# EAGLE design ESP32_breakout (EAGLE 9.1.3)
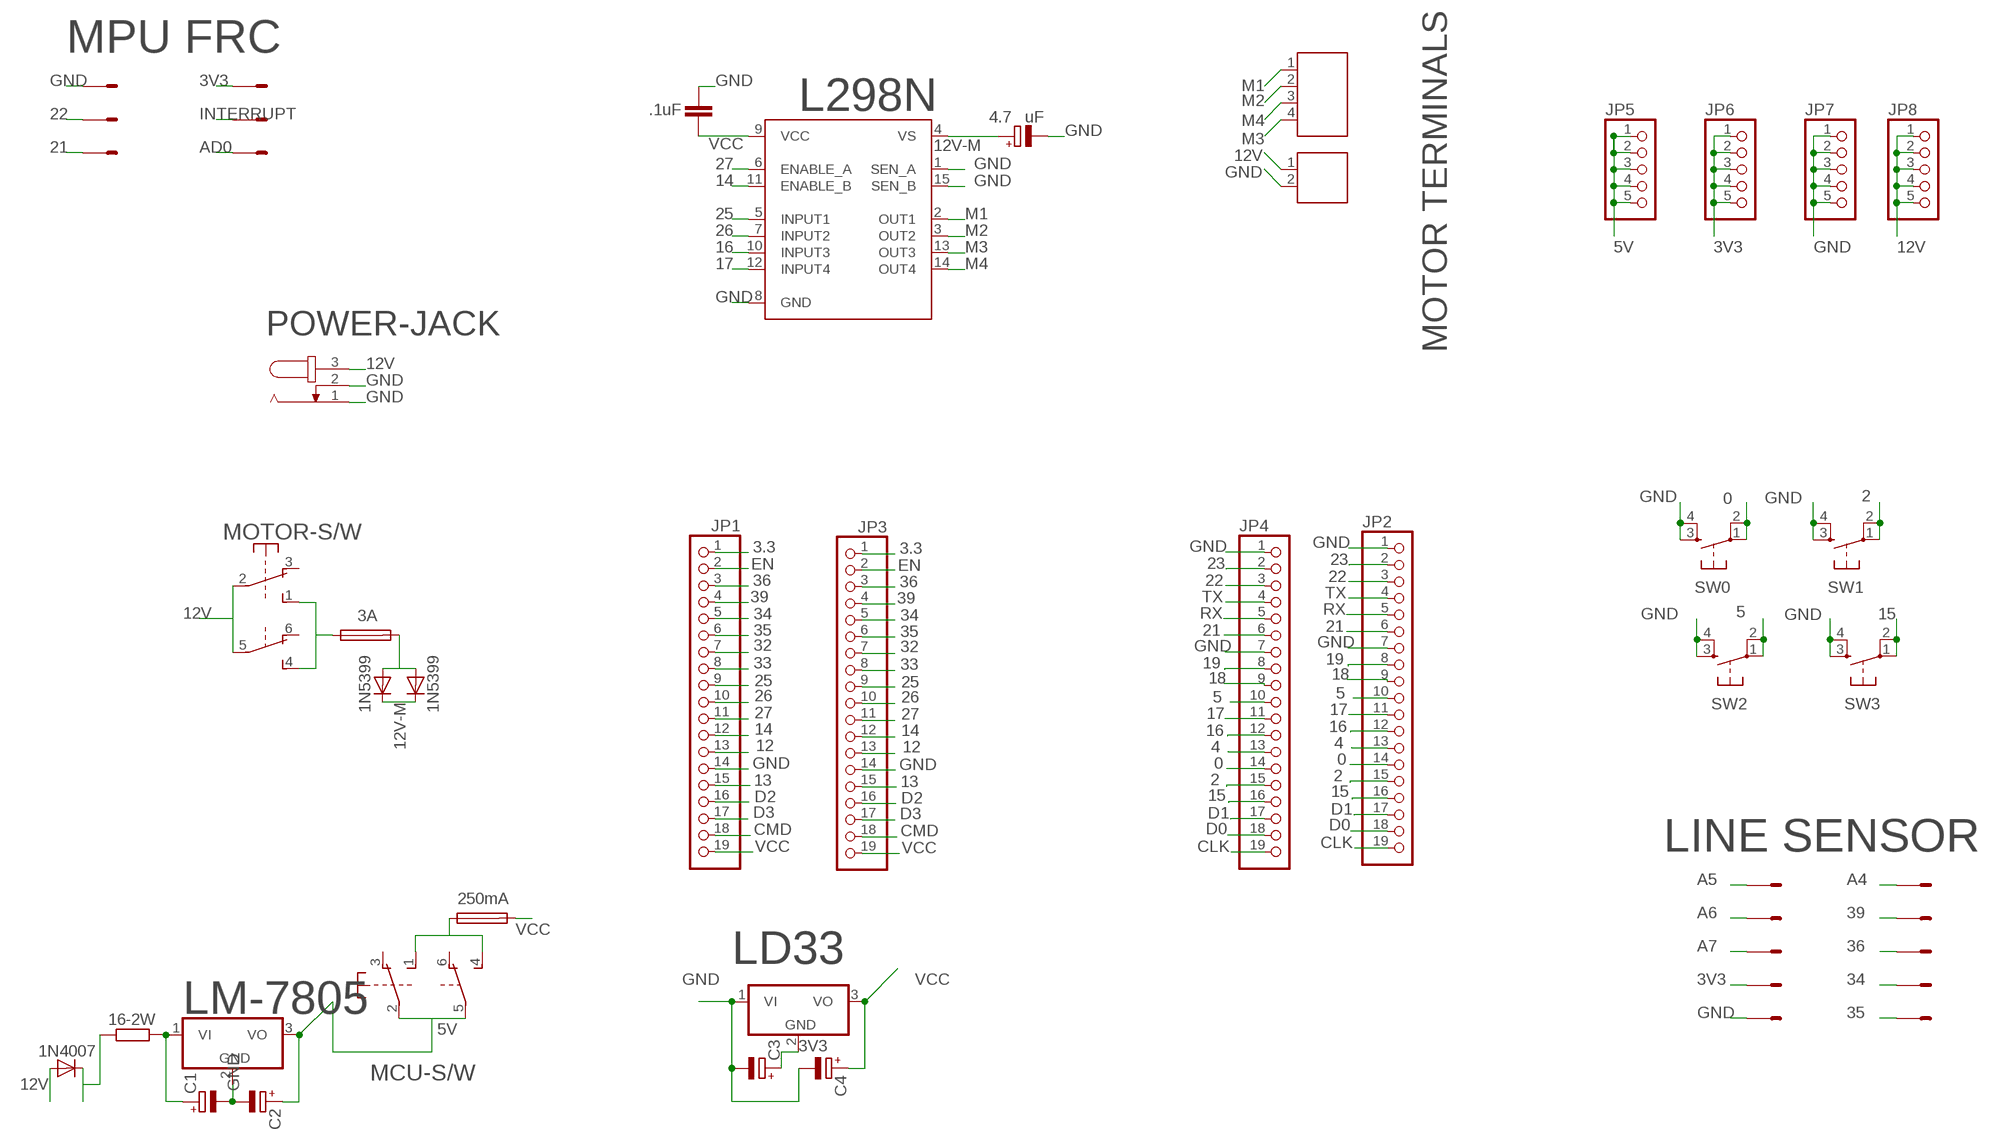
[diagram p0: schematic, sheet 1]

## Parts
12V  691131710002  [691131710002]
16-2W  R-EU_0617/17  [0617/17]
C1  CPOL-EUE2.5-6  [E2,5-6]
C2  CPOL-EUE2.5-6  [E2,5-6]
C3  CPOL-EUE2.5-6  [E2,5-6]
C4  CPOL-EUE2.5-6  [E2,5-6]
C8  4.7 uF  CPOL-EUE2.5-6  [E2,5-6]
C9  .1uF  C5/2.5  [C5B2.5]
D4  1N4007  DIODE-D-7.5  [D-7.5]
D6  1N5399  DIODE-DO15-12  [DO15-12]
D7  1N5399  DIODE-DO15-12  [DO15-12]
F1  3A  SH25  [SH25]
F2  250mA  SH25  [SH25]
J1  691131710004  [691131710004]
JP1  PINHD-1X19  [1X19]
JP2  PINHD-1X19  [1X19]
JP3  PINHD-1X19  [1X19]
JP4  PINHD-1X19  [1X19]
JP5  PINHD-1X5  [1X05]
JP6  PINHD-1X5  [1X05]
JP7  PINHD-1X5  [1X05]
JP8  PINHD-1X5  [1X05]
L298N  L298  [MULTIWATT-15]
LD33  786TV  [TO220V]
LINE-SENSOR  057-010-1  [057-010-1]
LM-7805  786TV  [TO220V]
MCU-S/W  9077-2  [9077-2]
MOTOR-S/W  9077-2  [9077-2]
MPU-6050  057-006-1  [057-006-1]
POWER-JACK  JACK-PLUG1  [SPC4078]
SW0  DTS-6  [DTS-6]
SW1  DTS-6  [DTS-6]
SW2  DTS-6  [DTS-6]
SW3  DTS-6  [DTS-6]

## Nets
0: JP2.14 JP4.14 SW0.1 SW0.2
2: JP2.15 JP4.15 SW1.1 SW1.2
3.3: JP1.1 JP3.1
3V3: C3.+ JP6.1 JP6.2 JP6.3 JP6.4 JP6.5 LD33.2(GND) LINE-SENSOR.7 MPU-6050.2
4: JP2.13 JP4.13
5: JP2.10 JP4.10 SW2.1 SW2.2
5V: C2.+ JP5.1 JP5.2 JP5.3 JP5.4 JP5.5 LM-7805.3(VO) MCU-S/W.2(1:P) MCU-S/W.5(2:P)
12: JP1.13 JP3.13
12V: 12V.1 D4.A JP8.1 JP8.2 JP8.3 JP8.4 JP8.5 MOTOR-S/W.2(1:P) MOTOR-S/W.5(2:P) POWER-JACK.3
12V-M: C8.+ D6.C D7.C L298N.4(VS)
13: JP1.15 JP3.15
14: JP1.12 JP3.12 L298N.11(ENABLE_B)
15: JP2.16 JP4.16 SW3.1 SW3.2
16: JP2.12 JP4.12 L298N.10(INPUT3)
17: JP2.11 JP4.11 L298N.12(INPUT4)
18: JP2.9 JP4.9
19: JP2.8 JP4.8
21: JP2.6 JP4.6 MPU-6050.5
22: JP2.3 JP4.3 MPU-6050.3
23: JP2.2 JP4.2
25: JP1.9 JP3.9 L298N.5(INPUT1)
26: JP1.10 JP3.10 L298N.7(INPUT2)
27: JP1.11 JP3.11 L298N.6(ENABLE_A)
32: JP1.7 JP3.7
33: JP1.8 JP3.8
34: JP1.5 JP3.5 LINE-SENSOR.8
35: JP1.6 JP3.6 LINE-SENSOR.10
36: JP1.3 JP3.3 LINE-SENSOR.6
39: JP1.4 JP3.4 LINE-SENSOR.4
A4: LINE-SENSOR.2
A5: LINE-SENSOR.1
A6: LINE-SENSOR.3
A7: LINE-SENSOR.5
CLK: JP2.19 JP4.19
CMD: JP1.18 JP3.18
D0: JP2.18 JP4.18
D1: JP2.17 JP4.17
D2: JP1.16 JP3.16
D3: JP1.17 JP3.17
EN: JP1.2 JP3.2
GND: 12V.2 C1.- C2.- C3.- C4.- C8.- C9.2 JP1.14 JP2.1 JP2.7 JP3.14 JP4.1 JP4.7 JP7.1 JP7.2 JP7.3 JP7.4 JP7.5 L298N.1(SEN_A) L298N.8(GND) L298N.15(SEN_B) LD33.1(VI) LINE-SENSOR.9 LM-7805.2(GND) MPU-6050.1 MPU-6050.6 POWER-JACK.1 POWER-JACK.2 SW0.3 SW0.4 SW1.3 SW1.4 SW2.3 SW2.4 SW3.3 SW3.4
INTERRUPT: MPU-6050.4
M1: J1.1 L298N.2(OUT1)
M2: J1.2 L298N.3(OUT2)
M3: J1.4 L298N.13(OUT3)
M4: J1.3 L298N.14(OUT4)
N$1: 16-2W.2 C1.+ LM-7805.1(VI)
N$3: F1.1 MOTOR-S/W.1(1:S) MOTOR-S/W.4(2:S)
N$6: F2.1 MCU-S/W.1(1:S) MCU-S/W.4(2:S)
N$8: 16-2W.1 D4.C
N$9: D6.A D7.A F1.2
RX: JP2.5 JP4.5
TX: JP2.4 JP4.4
VCC: C4.+ C9.1 F2.2 JP1.19 JP3.19 L298N.9(VCC) LD33.3(VO)
Unconnected: MCU-S/W.3(1:O) MCU-S/W.6(2:O) MOTOR-S/W.3(1:O) MOTOR-S/W.6(2:O)

## Notes on the sheet
- MPU FRC
- AD0
- MOTOR TERMINALS
- LINE SENSOR

## Library data of the parts
12V = Wurth_Elektronik_Electromechanic_Terminal_Blocks_Connectors_rev16b:691131710002: WR-TBL Terminal block - CUU5/2 CUU5/2GR - 2 Pins;=>Code : Con_TBL_Screw_PClamp_5.00_6911317100xx_691131710002 <http://katalog.we-online.de/media/images/eican/Con_TBL_Screw_PClamp_5.00_6911317100xx_pf2.jpg> Details see: http://katalog.we-online.de/em/datasheet/6911317100xx.pdf Created 11/23/2014, Karrer Zheng 2014 (C) Wurth Elektronik
16-2W = resistor:R-EU_: RESISTOR, European symbol
C1-C4 = rcl:CPOL-EU: POLARIZED CAPACITOR, European symbol; SPICEPREFIX: C
C8 = rcl:CPOL-EU: POLARIZED CAPACITOR, European symbol
C9 = capacitor-wima:C: CAPACITOR naming: grid - package width
D4 D6 D7 = diode:DIODE-: DIODE
F1 F2 = fuse:SH25: FUSE HOLDER grid 25 mm, OGN0031 8211, Schurter (Buerklin); MF: SCHURTER; MPN: 0031.8211; OC_FARNELL: 1162741; OC_NEWARK: 96B9380
J1 = Wurth_Elektronik_Electromechanic_Terminal_Blocks_Connectors_rev16b:691131710004: WR-TBL Terminal block - CUU5/4 - 4 Pins;=>Code : Con_TBL_Screw_PClamp_5.00_6911317100xx_691131710004 <http://katalog.we-online.de/media/images/eican/Con_TBL_Screw_PClamp_5.00_6911317100xx_pf2.jpg> Details see: http://katalog.we-online.de/em/datasheet/6911317100xx.pdf Created 11/3/2014, Karrer Zheng 2014 (C) Wurth Elektronik
JP1-JP4 = pinhead:PINHD-1X19: PIN HEADER
JP5-JP8 = pinhead:PINHD-1X5: PIN HEADER
L298N = st-microelectronics:L298: DUAL FULL-BRIDGE DRIVER; MPN: L298N; OC_FARNELL: 1589425; OC_NEWARK: 32M1527
LD33 LM-7805 = linear:78*: Positive VOLTAGE REGULATOR Source: http://cache.national.com/ds/LM/LM78L05.pdf http://www.fairchildsemi.com/ds/LM/LM7805.pdf
LINE-SENSOR = con-panduit:057-010-: CONNECTOR 10-pin series 057 contact pc board low profile headers; OC_FARNELL: unknown; OC_NEWARK: unknown
MCU-S/W MOTOR-S/W = switch-misc:9077-2: MARQUARDT SWITCH 9077.0200 Distributor: Buerklin <https://www.buerklin.com/default.asp?event=ShowArtikel%2812G2822%29&l=d&jump=ArtNr_12G2822>
MPU-6050 = con-panduit:057-006-: CONNECTOR 6-pin series 057 contact pc board low profile headers; OC_FARNELL: unknown; OC_NEWARK: unknown
POWER-JACK = con-jack:JACK-PLUG: DC POWER JACK Power Jack, DC, Right Angle, Through Hole, Rated 5A at 16VDC, PC Terminals Distributor: Farnell (www.Farnell.de) Drawing: 84N1161.pdf / 84N1162.pdf Manufacturer: SPC Technology (www.spctechnology.com) Type: SPC4077 / SPC 4078; OC_FARNELL: unknown; OC_NEWARK: unknown
SW0 SW1-SW3 = switch-tact:DTS-6

## Net classes
0 default: clearance 0.205 mm

## Board
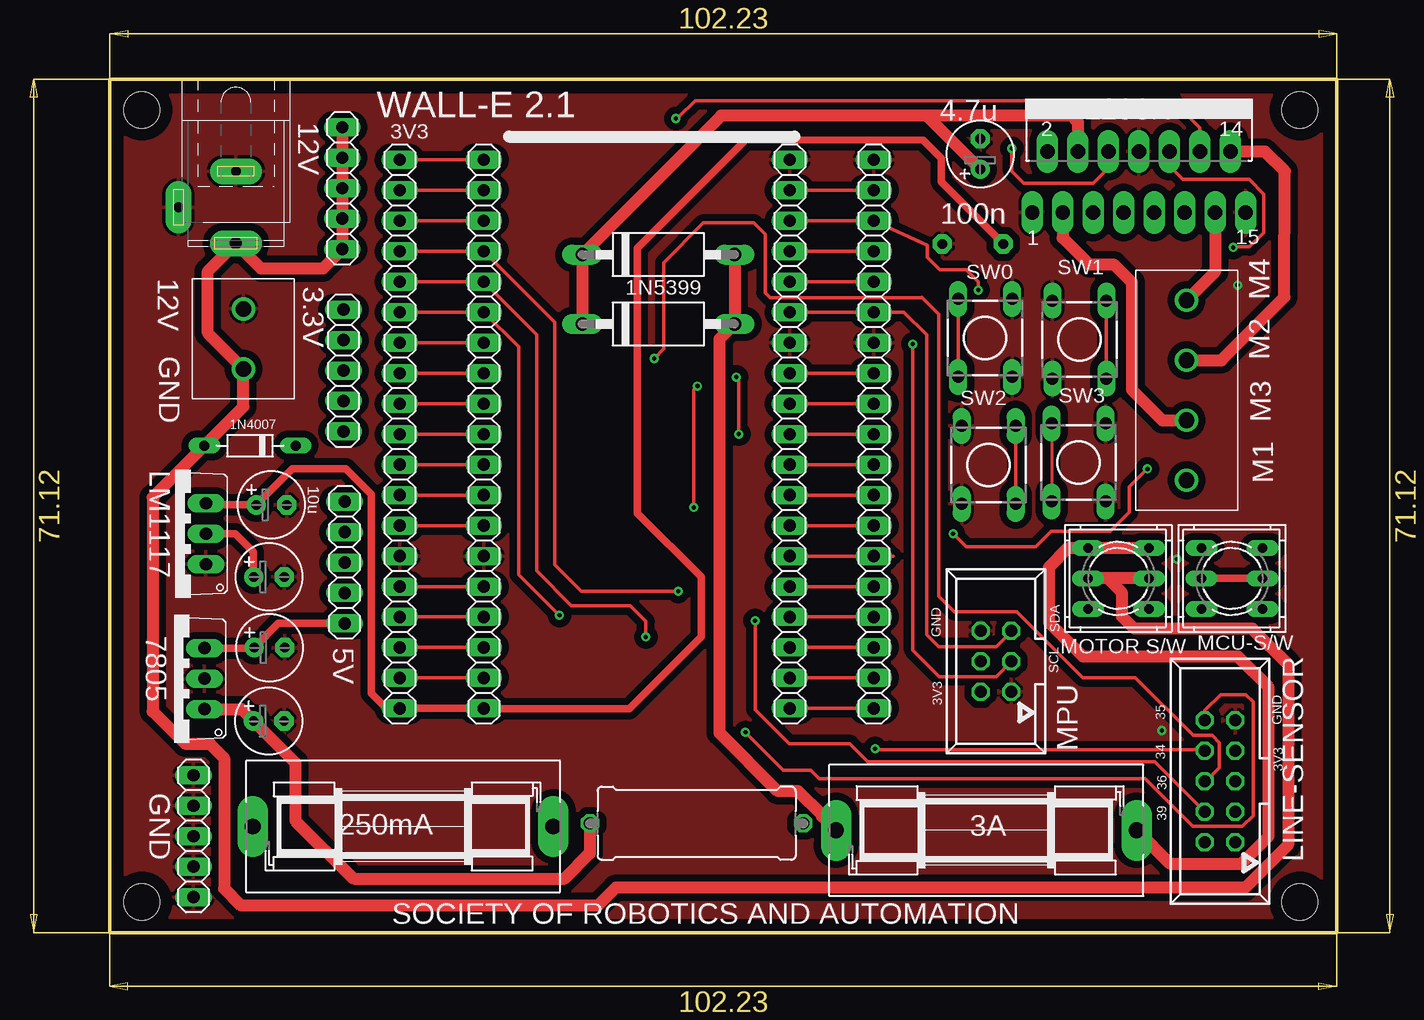
[diagram p1: board, top side]
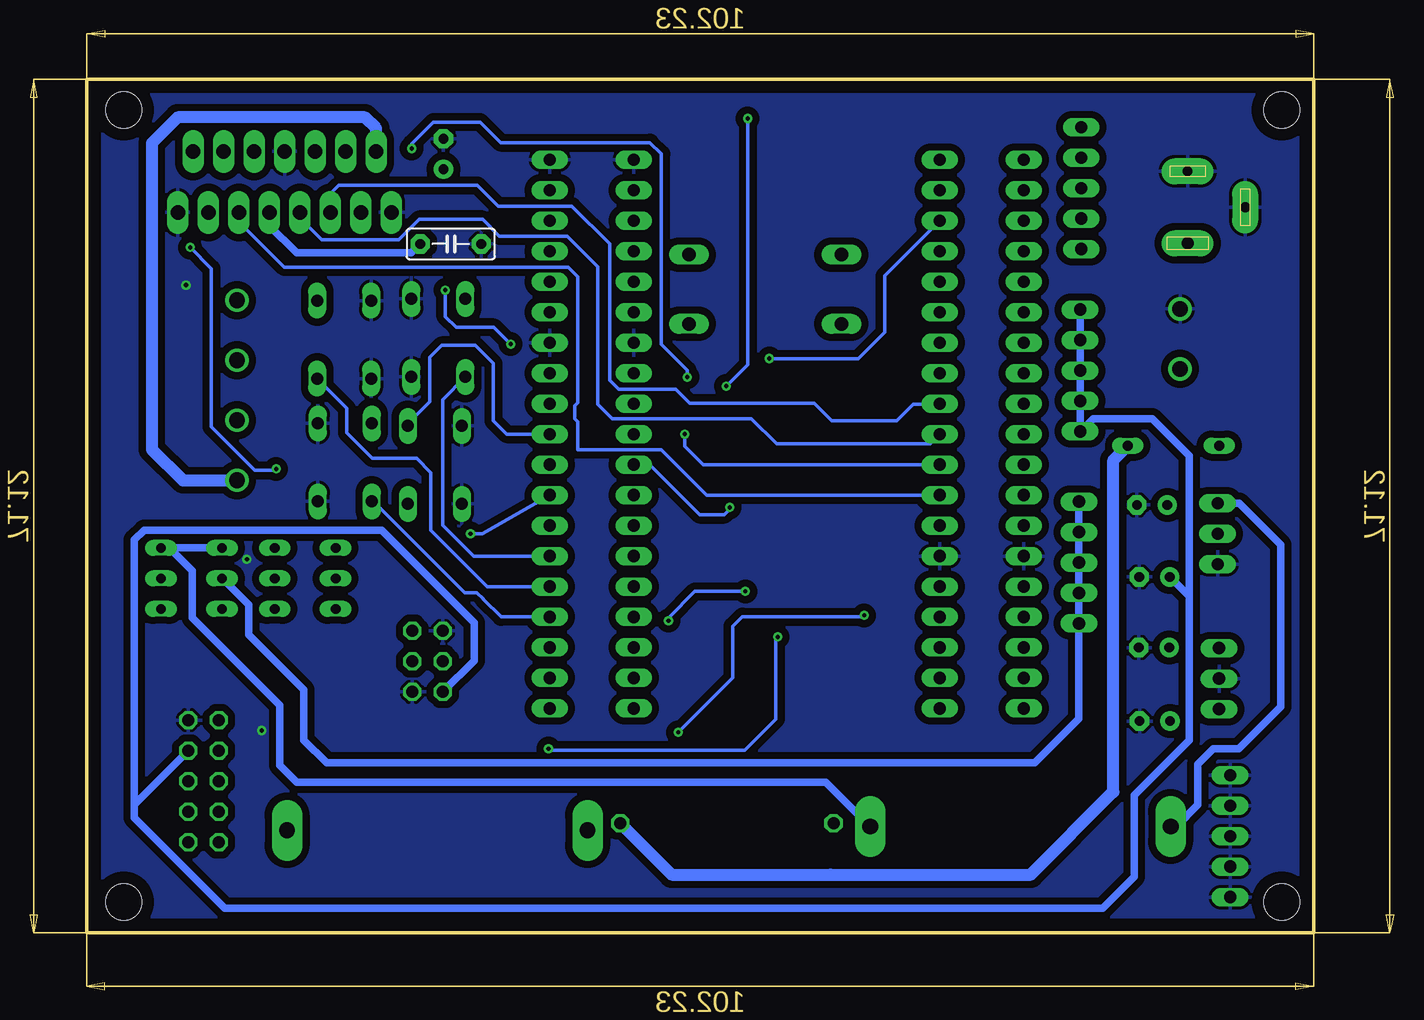
[diagram p2: board, bottom side, seen from below]

Size 102.23 x 71.12 mm. Coordinates in mm from the lower left corner, seen from the top.
Outline: 0,0 0,71.12 102.23,71.12 102.23,0 0,0
Copper layers (1*16): Top 0.035mm / dielectric 1.5mm / Bottom 0.035mm
Design rules "default *": minimum track width 6mil, minimum drill 0.35mm, track to track 0.6mm, track to pad 0.3mm, pad to pad 0.5mm, via to via 0.5mm, smd to smd 6mil, copper to edge 40mil, drill to drill 6mil, minimum pad ring 10mil, minimum via ring 8mil, stop-mask expansion 4mil, vias tented up to drill 0mil, thermal gap 10mil
Holes 3 mm at 2.67,68.56 2.67,2.55 99.17,2.55 99.17,68.56

### Footprints (pad centres in the part's own frame; a part is rotated, then mirrored left to right if it is on the bottom)
691131710002 = drill 1.3: 1 -2.5,0; 2 2.5,0
0617/17 = drill 1.016 octagon: 1 -8.89,0; 2 8.89,0
E2,5-6 = drill 0.813 pad 1.6: + -1.27,0 | drill 0.813 pad 1.6 octagon: - 1.27,0
C5B2.5 = drill 0.813 pad 1.6 octagon: 1 -2.54,0; 2 2.54,0
D-7.5 = drill 0.813 long: A 3.81,0; C -3.81,0
DO15-12 = drill 1.118 long: A 6.35,0; C -6.35,0
SH25 = drill 1.321 pad 2.54 long: 1 -12.522,0; 2 12.522,0
691131710004 = drill 1.3: 1 -7.5,0; 2 -2.5,0; 3 2.5,0; 4 7.5,0
1X19 = drill 1.016 long: 1 -22.86,0; 2 -20.32,0; 3 -17.78,0; 4 -15.24,0; 5 -12.7,0; 6 -10.16,0; 7 -7.62,0; 8 -5.08,0; 9 -2.54,0; 10 0,0; 11 2.54,0; 12 5.08,0; 13 7.62,0; 14 10.16,0; 15 12.7,0; 16 15.24,0; 17 17.78,0; 18 20.32,0; 19 22.86,0
1X05 = drill 1.016 long: 1 -5.08,0; 2 -2.54,0; 3 0,0; 4 2.54,0; 5 5.08,0
MULTIWATT-15 = drill 1.2 long: 1 -8.89,-7.62; 2 -7.62,-2.54; 3 -6.35,-7.62; 4 -5.08,-2.54; 5 -3.81,-7.62; 6 -2.54,-2.54; 7 -1.27,-7.62; 8 0,-2.54; 9 1.27,-7.62; 10 2.54,-2.54; 11 3.81,-7.62; 12 5.08,-2.54; 13 6.35,-7.62; 14 7.62,-2.54; 15 8.89,-7.62
TO220V = drill 1.016 long: 1 -2.54,-2.54; 2 0,-2.54; 3 2.54,-2.54
057-010-1 = drill 1 octagon: 1 -5.08,-1.27; 2 -5.08,1.27; 3 -2.54,-1.27; 4 -2.54,1.27; 5 0,-1.27; 6 0,1.27; 7 2.54,-1.27; 8 2.54,1.27; 9 5.08,-1.27; 10 5.08,1.27
9077-2 = drill 0.813 long: 1 -2.54,2.54; 2 0,2.54; 3 2.54,2.54; 4 -2.54,-2.54; 5 0,-2.54; 6 2.54,-2.54
057-006-1 = drill 1 octagon: 1 -2.54,-1.27; 2 -2.54,1.27; 3 0,-1.27; 4 0,1.27; 5 2.54,-1.27; 6 2.54,1.27
SPC4078 = drill 0.8 pad 2.184 long: 1 -3,0; 2 0,-4.8 | drill 1 pad 2.184 long: 3 3,0
DTS-6 = drill 1 long: 1 -3.25,2.25; 2 3.25,2.25; 3 -3.25,-2.25; 4 3.25,-2.25

### Placement (x,y rotation side)
12V  11.14,49.49 90 top
16-2W  48.9,9.12 180 top
C1  13.25,17.64 0 top
C2  13.31,23.77 0 top
C3  13.27,29.66 0 top
C4  13.47,35.66 0 top
C8  72.53,64.9 90 top
C9  71.92,57.41 0 bottom
D4  11.69,40.59 180 top
D6  45.72,50.73 0 top
D7  45.72,56.52 0 top
F1  73.04,8.54 180 top
F2  24.44,8.86 180 top
J1  89.73,45.2 90 top
JP1  24.17,41.55 270 top
JP2  63.67,41.55 270 top
JP3  31.17,41.55 270 top
JP4  56.67,41.55 270 top
JP5  19.57,30.85 270 top
JP6  19.47,46.85 90 top
JP7  6.97,8.05 270 top
JP8  19.37,62.05 90 top
L298N  85.76,67.65 0 top
LD33  5.47,33.26 90 top
LINE-SENSOR  92.51,12.63 90 top
LM-7805  5.35,21.18 90 top
MCU-S/W  93.52,29.52 270 top
MOTOR-S/W  84.05,29.52 270 top
MPU-6050  73.84,22.61 90 top
POWER-JACK  10.51,60.46 270 top
SW0  72.94,49.56 90 top
SW1  80.8,49.44 270 top
SW2  73.24,38.98 270 top
SW3  80.74,39.2 90 top

### Tracks (layer width: path | path; a pad name or v marks a point on that pad's centre or on a via)
0
  Top 0.305: JP4.14 65.27,31.4 JP2.14 | SW0.1 SW0.2
  Bottom 0.305: SW0.1 72.57,44.44 72.57,33.95 70.01,31.4 JP2.14
2
  Top 0.305: JP2.15 JP4.15 | SW1.2 SW1.1
  Bottom 0.305: JP2.15 68.87,28.85 73.57,33.55 73.57,38.35 74.77,39.55 78.47,39.55 80.57,41.66 80.57,43.7 SW1.2
3.3
  Top 0.305: JP1.1 JP3.1
3V3
  Top 0.61: LD33.2 10.47,33.26 11.97,31.76 11.97,29.69 C3.+
  Bottom 0.61: JP6.5 JP6.4 JP6.3 JP6.2 JP6.1 18.39,42.85 13.47,42.85 10.39,39.77 10.39,28.04 | 10.39,28.04 C3.+ | 10.39,28.04 10.37,28.02 10.37,16.05 14.97,11.46 14.97,4.65 17.57,2.05 90.77,2.05 98.29,9.58 98.29,10.66 | MPU-6050.2 69.97,22.68 69.97,25.86 77.67,33.55 97.47,33.55 98.29,32.73 98.29,10.66 | 98.29,10.66 97.89,11.06 LINE-SENSOR.7
4
  Top 0.305: JP2.13 JP4.13
5
  Top 0.305: JP4.10 JP2.10 | SW2.1 SW2.2
  Bottom 0.305: SW2.1 75.49,42.41 73.67,44.23 73.67,47.95 72.67,48.95 69.87,48.95 68.37,47.45 68.37,42.66 67.27,41.55 JP2.10
5V
  Top 0.61: MCU-S/W.5 MCU-S/W.2 | LM-7805.3 12,23.73 C2.+ 14.05,25.77 JP5.5
  Bottom 0.61: MCU-S/W.5 88.77,27.32 88.77,24.86 84.17,20.25 84.17,16.05 82.27,14.16 23.27,14.16 19.57,17.86 JP5.5 JP5.4 JP5.3 JP5.2 JP5.1
12
  Top 0.305: JP1.13 26.17,33.94 JP3.13
12V
  Top 1.016: MOTOR-S/W.2 83.17,29.52 | 83.17,29.52 MOTOR-S/W.5 | JP8.5 JP8.4 JP8.3 JP8.2 JP8.1 17.75,55.35 12.61,55.35 POWER-JACK.3 8.17,55.12 8.17,49.96 12V.1 11.14,43.84 D4.A 3.57,36.27 3.57,18.45 6.27,15.75 8.34,15.75 9.54,14.55 9.54,3.69 10.97,2.25 40.67,2.25 42.17,3.75 94.63,3.75 98.19,7.32 98.19,22.36 95.21,25.34 85.38,25.34 84.37,26.36 84.37,28.33 83.17,29.52
12V-M
  Top 1.016: D6.C D7.C 50.95,68.09 67.97,68.07 | L298N.4 80.68,67.54 80.16,68.07 67.98,68.07 67.97,68.07 | C8.+ 68.08,68.07 67.97,68.07
13
  Top 0.305: JP3.15 JP1.15
14
  Top 0.305: JP3.12 JP1.12
  Bottom 0.305: JP3.12 50.59,36.48 54.37,40.26 61.32,40.26 61.32,42.58 61.58,42.83 61.58,43.93 61.32,44.19 61.32,54.65 62.14,55.47 85.79,55.47 89.57,59.26 L298N.11
15
  Top 0.254: SW3.2 SW3.1
  Top 0.305: JP4.16 JP2.16
  Bottom 0.305: JP2.16 67.73,26.32 69.2,27.79 69.2,27.81 69.75,28.35 70.77,28.35 78.36,35.95 SW3.1
16  (via drill 0.35)
  Top 0.305: JP4.12 JP2.12 | v93.63,57.11 93.67,57.16 94.97,57.16 96.17,58.35 96.17,61.55 94.94,62.78 89.42,62.78 88.3,63.9 L298N.10 | v70.27,33.26 71.37,32.16 77.17,32.16 78.47,33.45 83.37,33.45 84.97,35.05 84.97,37.16 v86.47,38.66
  Bottom 0.305: v93.63,57.11 91.87,55.35 91.87,42.16 88.27,38.55 86.47,38.55 v86.47,38.66 | JP2.12 69.29,33.26 v70.27,33.26
17  (via drill 0.35)
  Top 0.305: JP2.11 JP4.11 | v48.97,45.55 48.67,45.26 v48.67,35.44 | L298N.12 90.84,67.09 88.57,69.35 48.77,69.35 47.37,67.96 47.27,67.96 v47.17,67.85
  Bottom 0.305: v47.17,67.85 47.17,47.35 v48.97,45.55 | JP4.11 55.33,39.02 51.17,34.85 49.12,34.85 48.67,35.3 v48.67,35.44
18
  Top 0.305: JP2.9 JP4.9
19
  Top 0.305: JP4.8 JP2.8
21
  Top 0.305: JP4.6 JP2.6 66.17,51.71 68.07,49.81 68.07,24.86 69.07,23.86 73.87,23.86 75.11,25.09 MPU-6050.5
22  (via drill 0.35)
  Top 0.305: JP4.3 JP2.3 68.12,57.28 68.12,56.3 69.17,55.26 71.37,55.26 72.37,54.26 v72.37,53.55 | MPU-6050.3 73.85,21.36 69.12,21.36 66.92,23.55 v66.92,49.05
  Bottom 0.305: v72.37,53.55 72.37,51.35 71.47,50.45 68.32,50.45 v66.92,49.05
23
  Top 0.305: JP4.2 JP2.2
25
  Top 0.305: JP1.9 JP3.9
  Bottom 0.305: JP3.9 31.21,44.05 33.37,44.05 34.77,42.66 40.17,42.66 41.64,44.12 51.99,44.12 53.17,45.31 57.92,45.31 58.67,46.05 58.67,57.41 61.82,60.55 67.97,60.55 69.7,62.28 81.24,62.28 81.95,61.57 L298N.5
26
  Top 0.305: JP3.10 JP1.10
  Bottom 0.305: JP3.10 31.97,40.76 44.77,40.76 46.87,42.85 58.47,42.85 59.67,44.05 59.67,55.51 62.22,58.05 67.87,58.05 69.27,59.45 74.56,59.45 76.26,57.76 82.67,57.76 84.49,59.57 L298N.7
27  (via drill 0.35)
  Top 0.305: JP1.11 JP3.11 | L298N.6 83.22,63.71 81.97,62.46 76.17,62.46 75.17,63.46 v75.17,65.35 | v52.42,41.55 52.42,46.09 v52.21,46.3
  Bottom 0.305: v75.17,65.35 75.17,65.75 73.37,67.56 69.47,67.56 67.77,65.85 55.32,65.85 54.37,64.91 54.37,49.05 52.21,46.89 v52.21,46.3 | JP3.11 50.88,39.02 52.42,40.55 v52.42,41.55
32
  Top 0.305: JP1.7 JP3.7
  Bottom 0.254: 31.25,49.26 JP3.7
  Bottom 0.305: JP3.7 31.25,49.26
33
  Top 0.305: JP3.8 JP1.8
34  (via drill 0.35)
  Top 0.305: JP1.5 JP3.5 35.57,49.85 35.57,30.16 38.47,27.25 43.37,27.25 44.67,25.95 v44.67,24.66 | LINE-SENSOR.8 91.18,15.23 65.03,15.23 65.01,15.25 63.77,15.25 v63.77,15.34
  Bottom 0.305: v44.67,24.66 44.82,24.5 44.82,17.8 47.41,15.21 63.63,15.21 63.75,15.34 v63.77,15.34
35  (via drill 0.35)
  Top 0.305: JP1.6 JP3.6 34.07,48.81 34.07,29.85 v37.47,26.45 | LINE-SENSOR.10 91.24,18.52 92.57,19.86 94.67,19.86 95.27,19.25 95.27,9.75 94.38,8.87 90.26,8.87 90.26,8.86 86.27,12.86 59.92,12.86 59.12,12.86 58.42,13.55 56.12,13.55 v52.97,16.7
  Bottom 0.305: v37.47,26.45 37.57,26.45 37.67,26.36 47.62,26.36 48.42,25.55 48.42,21.25 v52.97,16.7
36  (via drill 0.35)
  Top 0.305: JP1.3 JP3.3 | LINE-SENSOR.6 91.35,12.63 92.47,13.75 92.47,15.86 91.87,16.45 90.27,16.45 85.47,21.25 81.07,21.25 75.57,26.75 70.37,26.75 69.07,28.05 69.07,51.56 67.67,52.95 67.65,52.93 55.02,52.93 54.61,53.34 54.61,58.21 53.67,59.16 53.34,59.16 49.47,59.16 46.17,55.85 46.17,48.66 v45.37,47.85
  Bottom 0.305: JP3.3 35.77,54.73 35.77,50.05 37.97,47.85 v45.37,47.85
39  (via drill 0.35)
  Top 0.305: JP1.4 JP3.4 37.07,50.9 37.07,30.66 39.27,28.45 v47.37,28.45 | LINE-SENSOR.4 87.06,14.27 63.16,14.27 61.67,15.75 56.62,15.75 53.77,18.61 v53.77,26
  Bottom 0.305: v47.37,28.45 51.57,28.45 53.77,26.25 v53.77,26
CLK
  Top 0.305: JP4.19 JP2.19
CMD
  Top 0.305: JP1.18 JP3.18
D0
  Top 0.305: JP4.18 JP2.18
D1
  Top 0.305: JP2.17 JP4.17
D2
  Top 0.305: JP1.16 JP3.16
D3
  Top 0.305: JP3.17 JP1.17
EN
  Top 0.305: JP3.2 JP1.2
GND  (via drill 0.35)
  other vias: 87.67,16.86 88.9,31.12 93.98,53.98
  pour Top: 0,71.12 102.23,71.12 102.23,0 0,0
  pour Top (isolate 0.305): 0,71.12 102.23,71.12 102.23,0 0,0
  pour Bottom (isolate 0.305): 0,71.12 0,0 102.23,0 102.23,71.12
M1
  Bottom 1.016: L298N.2 78.14,67.03 79.07,67.96 94.67,67.96 96.81,65.81 96.81,40.29 94.23,37.7 J1.1
M2
  Top 1.016: L298N.3 79.41,57.91 81.62,55.71 83.66,55.71 85.17,54.19 85.17,45.26 87.72,42.7 J1.2
M3
  Top 1.016: L298N.13 92.11,55.09 J1.4
M4
  Top 1.016: L298N.14 96.25,65.1 97.92,63.45 97.89,52.96 92.63,47.7 J1.3
N$1
  Top 1.016: LM-7805.1 10.98,18.64 C1.+ 15.47,14.16 15.47,9.36 20.31,4.51 37.9,4.51 40.01,6.62 16-2W.2
N$3
  Top 1.016: F1.1 88.34,5.75 94.27,5.75 96.57,8.06 96.57,20.45 94.01,23.02 81.11,23.02 78.27,25.86 78.27,30.45 79.88,32.06 MOTOR-S/W.4 MOTOR-S/W.1
N$6
  Bottom 0.61: MCU-S/W.4 MCU-S/W.1 95.38,32.06 93.47,30.16 93.47,26.25 86.17,18.95 86.17,13.95 84.77,12.55 40.66,12.55 F2.1
N$8
  Bottom 1.016: 16-2W.1 53.52,4.86 40.27,4.86 23.57,4.86 16.69,11.73 16.69,39.4 D4.C
N$9
  Top 1.016: D7.A D6.A 50.82,49.48 50.82,16.66 55.67,11.8 57.33,11.8 59.36,9.78 59.36,9.69 F1.2
RX
  Top 0.305: JP2.5 JP4.5
TX
  Top 0.305: JP4.4 JP2.4
VCC
  Top 0.61: LD33.3 8.15,35.66 C4.+ 15.2,38.66 19.67,38.66 21.77,36.55 21.77,19.95 23.03,18.7 JP1.19 30.87,18.7 | 30.87,18.7 JP3.19 | C9.1 69.27,62.6 69.27,64.56 67.77,66.05 52.98,66.06 43.97,57.05 43.97,34.95 49.27,29.66 49.27,24.66 43.27,18.66 30.91,18.66 30.87,18.7
  Bottom 0.61: L298N.9 87.03,58.99 87.07,58.95 84.77,56.66 75.21,56.66 C9.1 | LD33.3 6.21,35.8 2.77,32.35 2.77,18.86 6.27,15.36 8.37,15.36 9.67,14.05 9.67,10.65 11.47,8.86 F2.2

### Text on the board
tSilk: WALL-E 2.1 | 4.7u | L298N | 3V3 | 100n | 12V | SW0 | SW1 | 1N5399 | M4 | GND | M2 | SW3 | SW2 | M3 | 10u | M1 | SDA | 7805 | GND | MOTOR S/W | MCU-S/W | SCL | 3V3 | 35 | GND | MPU | 34 | 36 | 3V3 | 39 | 250mA | 3A | LINE-SENSOR | SOCIETY OF ROBOTICS AND AUTOMATION
_tsilk: 12V | 3.3V | 1N4007 | LM1117 | 5V | GND